# Altium schematic sheet FCC.SchDoc
size 297 x 209 mm
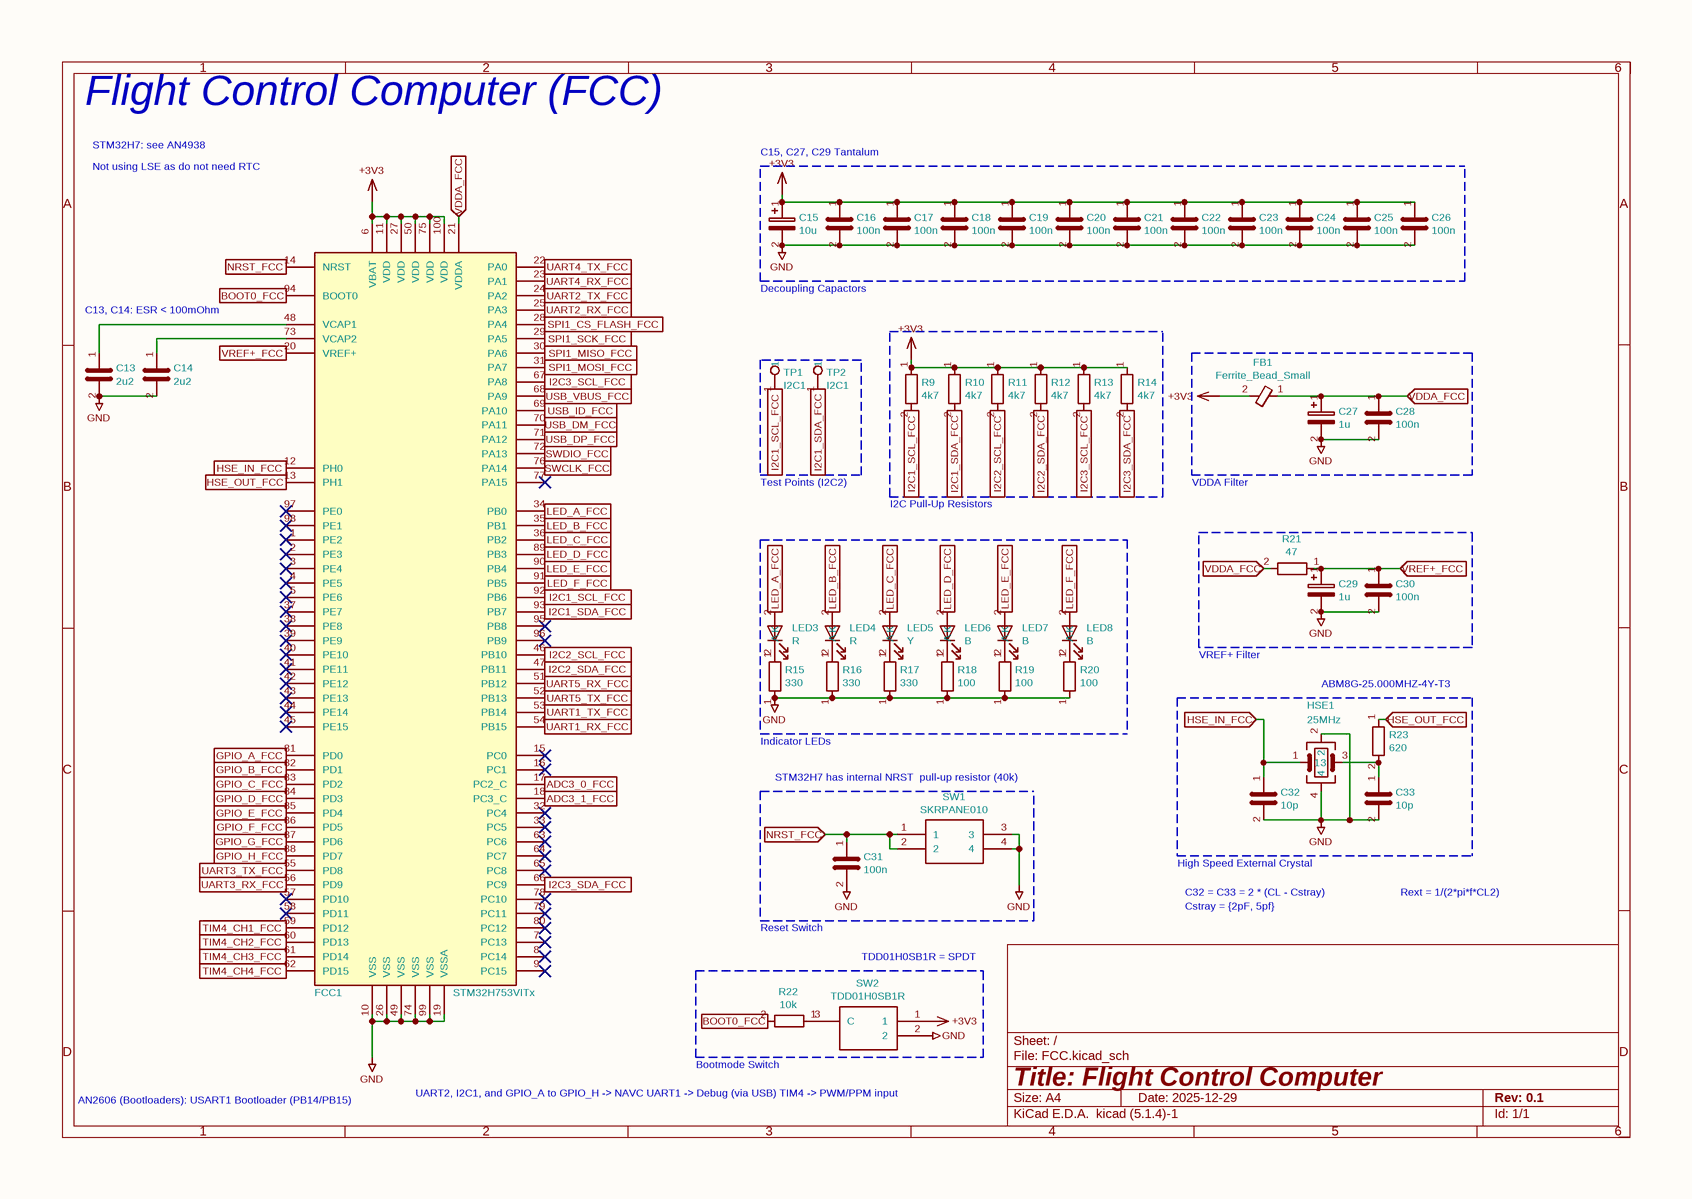
[diagram p0: FCC.SchDoc]

## Parts
C13  2u2  [C_0603_1608Metric]
C14  2u2  [C_0603_1608Metric]
C15  10u  [C_0603_1608Metric]
C16  100n  [C_0402_1005Metric]
C17  100n  [C_0402_1005Metric]
C18  100n  [C_0402_1005Metric]
C19  100n  [C_0402_1005Metric]
C20  100n  [C_0402_1005Metric]
C21  100n  [C_0402_1005Metric]
C22  100n  [C_0402_1005Metric]
C23  100n  [C_0402_1005Metric]
C24  100n  [C_0402_1005Metric]
C25  100n  [C_0402_1005Metric]
C26  100n  [C_0402_1005Metric]
C27  1u  [C_0603_1608Metric]
C28  100n  [C_0402_1005Metric]
C29  1u  [C_0603_1608Metric]
C30  100n  [C_0402_1005Metric]
C31  100n  [C_0402_1005Metric]
C32  10p  [C_0402_1005Metric]
C33  10p  [C_0402_1005Metric]
FB1  Ferrite_Bead_Small  [L_0402_1005Metric]
FCC1  STM32H753VITx  [LQFP-100_14x14mm_P0.5mm]
HSE1  25MHz  [Crystal_SMD_Abracon_ABM8G-4Pin_3.2x2.5mm]
LED3  R  [LED_0603_1608Metric]
LED4  R  [LED_0603_1608Metric]
LED5  Y  [LED_0603_1608Metric]
LED6  B  [LED_0603_1608Metric]
LED7  B  [LED_0603_1608Metric]
LED8  B  [LED_0603_1608Metric]
R9  4k7  [R_0402_1005Metric]
R10  4k7  [R_0402_1005Metric]
R11  4k7  [R_0402_1005Metric]
R12  4k7  [R_0402_1005Metric]
R13  4k7  [R_0402_1005Metric]
R14  4k7  [R_0402_1005Metric]
R15  330  [R_0603_1608Metric]
R16  330  [R_0603_1608Metric]
R17  330  [R_0603_1608Metric]
R18  100  [R_0603_1608Metric]
R19  100  [R_0603_1608Metric]
R20  100  [R_0603_1608Metric]
R21  47  [R_0402_1005Metric]
R22  10k  [R_0402_1005Metric]
R23  620  [R_0603_1608Metric]
SW1  SKRPANE010  [SKRPADE010]
SW2  TDD01H0SB1R  [SOT175P420X230-3N]
TP1  I2C1  [TestPoint_Pad_D1.5mm]
TP2  I2C1  [TestPoint_Pad_D1.5mm]

## Blocks framed on the sheet
C15, C27, C29 Tantalum: C15-C26
ABM8G-25.000MHZ-4Y-T3: C32 C33 HSE1 R23
STM32H7 has internal NRST / pull-up resistor (40k): C31 SW1
TDD01H0SB1R = SPDT: R22 SW2

## Ports
ADC3_0_FCC (in), ADC3_1_FCC (in), BOOT0_FCC (in), GPIO_A_FCC (in), GPIO_B_FCC (in), GPIO_C_FCC (in), GPIO_D_FCC (in), GPIO_E_FCC (in), GPIO_F_FCC (in), GPIO_G_FCC (in), GPIO_H_FCC (in), HSE_IN_FCC (in), HSE_OUT_FCC (in), I2C1_SCL_FCC (in), I2C1_SDA_FCC (in), I2C2_SCL_FCC (in), I2C2_SDA_FCC (in), I2C3_SCL_FCC (in), I2C3_SDA_FCC (in), LED_A_FCC (in), LED_B_FCC (in), LED_C_FCC (in), LED_D_FCC (in), LED_E_FCC (in), LED_F_FCC (in), NRST_FCC (in), SPI1_CS_FLASH_FCC (in), SPI1_MISO_FCC (in), SPI1_MOSI_FCC (in), SPI1_SCK_FCC (in), SWCLK_FCC (in), SWDIO_FCC (in), TIM4_CH1_FCC (in), TIM4_CH2_FCC (in), TIM4_CH3_FCC (in), TIM4_CH4_FCC (in), UART1_RX_FCC (in), UART1_TX_FCC (in), UART2_RX_FCC (in), UART2_TX_FCC (in), UART3_RX_FCC (in), UART3_TX_FCC (in), UART4_RX_FCC (in), UART4_TX_FCC (in), UART5_RX_FCC (in), UART5_TX_FCC (in), USB_DM_FCC (in), USB_DP_FCC (in), USB_ID_FCC (in), USB_VBUS_FCC (in), VDDA_FCC (in), VREF+_FCC (in)

## Nets
+3V3: C15.1 C16.1 C17.1 C18.1 C19.1 C20.1 C21.1 C22.1 C23.1 C24.1 C25.1 C26.1 FB1.2 FCC1.6(VBAT) FCC1.11(VDD) FCC1.27(VDD) FCC1.50(VDD) FCC1.75(VDD) FCC1.100(VDD) R9.1 R10.1 R11.1 R12.1 R13.1 R14.1 SW2.1
GND: C13.2 C14.2 C15.2 C16.2 C17.2 C18.2 C19.2 C20.2 C21.2 C22.2 C23.2 C24.2 C25.2 C26.2 C27.2 C28.2 C29.2 C30.2 C31.2 C32.2 C33.2 FCC1.10(VSS) FCC1.19(VSSA) FCC1.26(VSS) FCC1.49(VSS) FCC1.74(VSS) FCC1.99(VSS) HSE1.2 HSE1.4 R15.1 R16.1 R17.1 R18.1 R19.1 R20.1 SW1.3 SW1.4 SW2.2
ADC3_0_FCC: FCC1.17(PC2_C) ; port ADC3_0_FCC
ADC3_1_FCC: FCC1.18(PC3_C) ; port ADC3_1_FCC
BOOT0_FCC: FCC1.94(BOOT0) R22.2 ; port BOOT0_FCC
GPIO_A_FCC: FCC1.81(PD0) ; port GPIO_A_FCC
GPIO_B_FCC: FCC1.82(PD1) ; port GPIO_B_FCC
GPIO_C_FCC: FCC1.83(PD2) ; port GPIO_C_FCC
GPIO_D_FCC: FCC1.84(PD3) ; port GPIO_D_FCC
GPIO_E_FCC: FCC1.85(PD4) ; port GPIO_E_FCC
GPIO_F_FCC: FCC1.86(PD5) ; port GPIO_F_FCC
GPIO_G_FCC: FCC1.87(PD6) ; port GPIO_G_FCC
GPIO_H_FCC: FCC1.88(PD7) ; port GPIO_H_FCC
HSE_IN_FCC: C32.1 FCC1.12(PH0) HSE1.1 ; port HSE_IN_FCC
HSE_OUT_FCC: FCC1.13(PH1) R23.1 ; port HSE_OUT_FCC
I2C1_SCL_FCC: FCC1.92(PB6) R9.2 TP1.1 ; port I2C1_SCL_FCC
I2C1_SDA_FCC: FCC1.93(PB7) R10.2 TP2.1 ; port I2C1_SDA_FCC
I2C2_SCL_FCC: FCC1.46(PB10) R11.2 ; port I2C2_SCL_FCC
I2C2_SDA_FCC: FCC1.47(PB11) R12.2 ; port I2C2_SDA_FCC
I2C3_SCL_FCC: FCC1.67(PA8) R13.2 ; port I2C3_SCL_FCC
I2C3_SDA_FCC: FCC1.66(PC9) R14.2 ; port I2C3_SDA_FCC
LED_A_FCC: FCC1.34(PB0) LED3.2(A) ; port LED_A_FCC
LED_B_FCC: FCC1.35(PB1) LED4.2(A) ; port LED_B_FCC
LED_C_FCC: FCC1.36(PB2) LED5.2(A) ; port LED_C_FCC
LED_D_FCC: FCC1.89(PB3) LED6.2(A) ; port LED_D_FCC
LED_E_FCC: FCC1.90(PB4) LED7.2(A) ; port LED_E_FCC
LED_F_FCC: FCC1.91(PB5) LED8.2(A) ; port LED_F_FCC
NRST_FCC: C31.1 FCC1.14(NRST) SW1.1 SW1.2 ; port NRST_FCC
SPI1_CS_FLASH_FCC: FCC1.28(PA4) ; port SPI1_CS_FLASH_FCC
SPI1_MISO_FCC: FCC1.30(PA6) ; port SPI1_MISO_FCC
SPI1_MOSI_FCC: FCC1.31(PA7) ; port SPI1_MOSI_FCC
SPI1_SCK_FCC: FCC1.29(PA5) ; port SPI1_SCK_FCC
SWCLK_FCC: FCC1.76(PA14) ; port SWCLK_FCC
SWDIO_FCC: FCC1.72(PA13) ; port SWDIO_FCC
TIM4_CH1_FCC: FCC1.59(PD12) ; port TIM4_CH1_FCC
TIM4_CH2_FCC: FCC1.60(PD13) ; port TIM4_CH2_FCC
TIM4_CH3_FCC: FCC1.61(PD14) ; port TIM4_CH3_FCC
TIM4_CH4_FCC: FCC1.62(PD15) ; port TIM4_CH4_FCC
UART1_RX_FCC: FCC1.54(PB15) ; port UART1_RX_FCC
UART1_TX_FCC: FCC1.53(PB14) ; port UART1_TX_FCC
UART2_RX_FCC: FCC1.25(PA3) ; port UART2_RX_FCC
UART2_TX_FCC: FCC1.24(PA2) ; port UART2_TX_FCC
UART3_RX_FCC: FCC1.56(PD9) ; port UART3_RX_FCC
UART3_TX_FCC: FCC1.55(PD8) ; port UART3_TX_FCC
UART4_RX_FCC: FCC1.23(PA1) ; port UART4_RX_FCC
UART4_TX_FCC: FCC1.22(PA0) ; port UART4_TX_FCC
UART5_RX_FCC: FCC1.51(PB12) ; port UART5_RX_FCC
UART5_TX_FCC: FCC1.52(PB13) ; port UART5_TX_FCC
USB_DM_FCC: FCC1.70(PA11) ; port USB_DM_FCC
USB_DP_FCC: FCC1.71(PA12) ; port USB_DP_FCC
USB_ID_FCC: FCC1.69(PA10) ; port USB_ID_FCC
USB_VBUS_FCC: FCC1.68(PA9) ; port USB_VBUS_FCC
VDDA_FCC: C27.1 C28.1 FB1.1 FCC1.21(VDDA) R21.2 ; port VDDA_FCC
VREF+_FCC: C29.1 C30.1 FCC1.20(VREF+) R21.1 ; port VREF+_FCC
NetC13_1: C13.1 FCC1.48(VCAP1)
NetC14_1: C14.1 FCC1.73(VCAP2)
NetC33_1: C33.1 HSE1.3 R23.2
NetLED3_1: LED3.1(K) R15.2
NetLED4_1: LED4.1(K) R16.2
NetLED5_1: LED5.1(K) R17.2
NetLED6_1: LED6.1(K) R18.2
NetLED7_1: LED7.1(K) R19.2
NetLED8_1: LED8.1(K) R20.2
NetR22_1: R22.1 SW2.3(C)

Not connected (* = marked no-connect by the designer): FCC1 1(PE2)* 2(PE3)* 3(PE4)* 4(PE5)* 5(PE6)* 7(PC13)* 8(PC14)* 9(PC15)* 15(PC0)* 16(PC1)* 32(PC4)* 33(PC5)* 37(PE7)* 38(PE8)* 39(PE9)* 40(PE10)* 41(PE11)* 42(PE12)* 43(PE13)* 44(PE14)* 45(PE15)* 57(PD10)* 58(PD11)* 63(PC6)* 64(PC7)* 65(PC8)* 77(PA15)* 78(PC10)* 79(PC11)* 80(PC12)* 95(PB8)* 96(PB9)* 97(PE0)* 98(PE1)*

## Notes on the sheet
- Flight Control Computer (FCC)
- Not using LSE as do not need RTC
- STM32H7: see AN4938
- C13, C14: ESR < 100mOhm
- Decoupling Capactors
- Test Points (I2C2)
- I2C Pull-Up Resistors
- VDDA Filter
- VREF+ Filter
- Indicator LEDs
- Reset Switch
- High Speed External Crystal
- C32 = C33 = 2 * (CL - Cstray)
- Cstray = {2pF, 5pf}
- Rext = 1/(2*pi*f*CL2)
- (near R22) Bootmode Switch
- AN2606 (Bootloaders): USART1 Bootloader (PB14/PB15)
- UART2, I2C1, and GPIO_A to GPIO_H -> NAVC
  UART1 -> Debug (via USB)
  TIM4 -> PWM/PPM input
- 1
- 2
- 3
- 4
- 5
- 6
- A
- B
- C
- D
- Title: Flight Control Computer
- File: FCC.kicad_sch
- Sheet: /
- KiCad E.D.A.  kicad (5.1.4)-1
- Size: A4
- Date: 2025-12-29
- Rev: 0.1
- Id: 1/1

## Library data of the parts
C13 C14 C16-C26 C28 C30-C33 = C
  C13 C14: Value: 2u2; Footprint: Capacitor_SMD:C_0603_1608Metric
  C16-C26 C28 C30 C31: Value: 100n; Footprint: Capacitor_SMD:C_0402_1005Metric
  C32 C33: Value: 10p; Footprint: Capacitor_SMD:C_0402_1005Metric
C15 C27 C29 = CP-Device: Footprint: Capacitor_SMD:C_0603_1608Metric
  C15: Value: 10u
  C27 C29: Value: 1u
FB1 = Ferrite_Bead_Small-Device: Value: Ferrite_Bead_Small; Footprint: Inductor_SMD:L_0402_1005Metric
FCC1 = STM32H753VITx-MCU_ST_STM32H7: Value: STM32H753VITx; Footprint: Package_QFP:LQFP-100_14x14mm_P0.5mm
HSE1 = Crystal_GND24: Value: 25MHz; Footprint: Crystal:Crystal_SMD_Abracon_ABM8G-4Pin_3.2x2.5mm
LED3-LED8 = LED: Footprint: LED_SMD:LED_0603_1608Metric
  LED3 LED4: Value: R
  LED5: Value: Y
  LED6-LED8: Value: B
R9-R23 = R
  R9-R14: Value: 4k7; Footprint: Resistor_SMD:R_0402_1005Metric
  R15-R17: Value: 330; Footprint: Resistor_SMD:R_0603_1608Metric
  R18-R20: Value: 100; Footprint: Resistor_SMD:R_0603_1608Metric
  R21: Value: 47; Footprint: Resistor_SMD:R_0402_1005Metric
  R22: Value: 10k; Footprint: Resistor_SMD:R_0402_1005Metric
  R23: Value: 620; Footprint: Resistor_SMD:R_0603_1608Metric
SW1 = SKRPANE010: Manufacturer_Name: ALPS; Height: 2; Manufacturer_Part_Number: SKRPANE010; Mouser Part Number: 688-SKRPANE010; Mouser Price/Stock: https://www.mouser.com/Search/Refine.aspx?Keyword=688-SKRPANE010; Value: SKRPANE010; Footprint: SKRPANE010:SKRPADE010
SW2 = TDD01H0SB1R: Manufacturer_Name: C & K COMPONENTS; Height: 2.3; Manufacturer_Part_Number: TDD01H0SB1R; Mouser Part Number: 611-TDD01H0SB1R; Mouser Price/Stock: https://www.mouser.com/Search/Refine.aspx?Keyword=611-TDD01H0SB1R; Value: TDD01H0SB1R; Footprint: TDD01H0SB1R:SOT175P420X230-3N
TP1 TP2 = TestPoint: Value: I2C1; Footprint: TestPoint:TestPoint_Pad_D1.5mm